# EAGLE schematic shift-one (EAGLE 5.07)
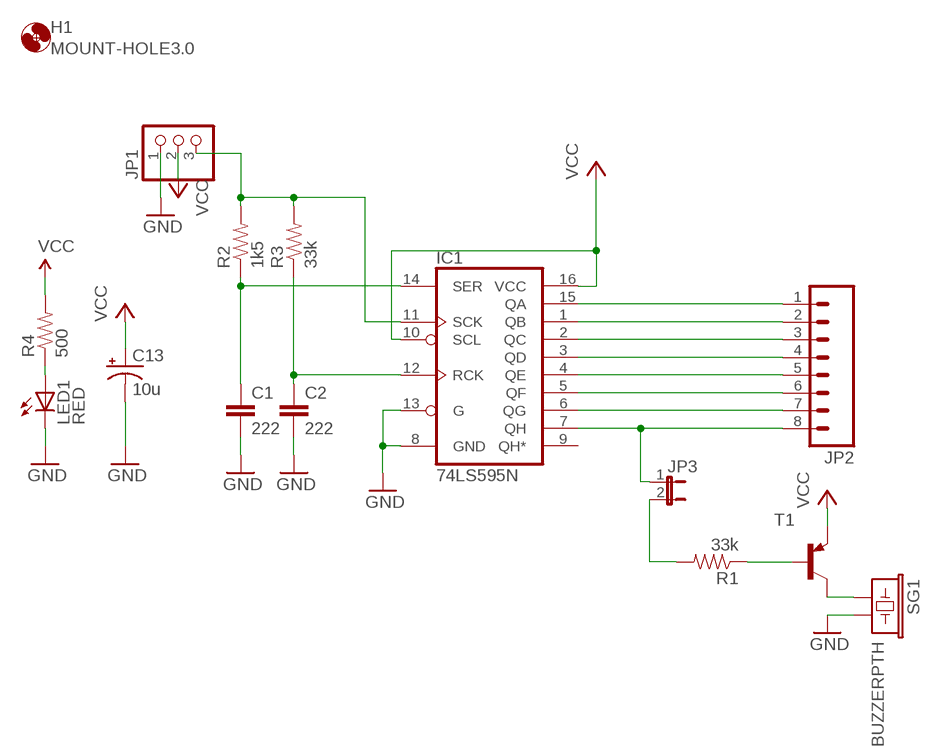
[diagram p0: schematic, sheet 1]

## Parts
C1  222  CAP0805  [0805]
C2  222  CAP0805  [0805]
C13  10u  CAP_POLPTH1  [CPOL-RADIAL-100UF-25V]
H1  MOUNT-HOLE3.0  [3,0]
IC1  74LS595N  [DIL16]
JP1  PINHD-1X3/90  [1X03/90]
JP2  M08LOCK_LONGPADS  [1X08_LOCK_LONGPADS]
JP3  JUMPER-2PTH_LOCK  [1X02_LOCK]
LED1  RED  LED3MM  [LED3MM]
R1  33k  RESISTOR0805  [0805]
R2  1k5  RESISTOR1/4W  [AXIAL-0.3]
R3  33k  RESISTOR0805  [0805]
R4  500  RESISTOR0805  [0805]
SG1  BUZZERPTH  [BUZZER-12MM]
T1  90**-PNP-SOT23-BEC  [SOT23-BEC]

## Nets
GND: C1.2 C2.2 C13.2(-) IC1.8(GND) IC1.13(G) JP1.1 LED1.K(C) SG1.-
N$1: IC1.15(QA) JP2.1
N$2: IC1.1(QB) JP2.2
N$3: IC1.2(QC) JP2.3
N$4: IC1.3(QD) JP2.4
N$5: IC1.4(QE) JP2.5
N$6: IC1.5(QF) JP2.6
N$7: IC1.6(QG) JP2.7
N$9: IC1.11(SCK) JP1.3 R2.P$2 R3.2
N$10: C2.1 IC1.12(RCK) R3.1
N$11: C1.1 IC1.14(SER) R2.P$1
N$12: LED1.A R4.1
N$13: SG1.+ T1.C
N$14: R1.1 T1.B
N$15: JP3.2 R1.2
N$16: IC1.7(QH) JP2.8 JP3.1
VCC: C13.1(+) IC1.10(SCL) IC1.16(VCC) JP1.2 R4.2 T1.E
Unconnected: IC1.9(QH*)

## Library data of the parts
C1 C2 = digital-toy:CAP: Capacitor Standard 0603 ceramic capacitor, and 0.1" leaded capacitor.
C13 = SparkFun:CAP_POL: Capacitor Polarized These are standard SMD and PTH capacitors. Normally 10uF, 47uF, and 100uF in electrolytic and tantalum varieties. Always verify the external diameter of the through hole cap, it varies with capacity, voltage, and manufacturer. The EIA devices should be standard.
H1 = holes:MOUNT-HOLE: MOUNTING HOLE with drill center marker
IC1 = SparkFun:74*595: 8-bit SHIFT REGISTER, output latch
JP1 = pinhead:PINHD-1X3: PIN HEADER
JP2 = SparkFun:M08: Header 8 Standard 8-pin 0.1" header. Use with straight break away headers (SKU : PRT-00116), right angle break away headers (PRT-00553), swiss pins (PRT-00743), machine pins (PRT-00117), and female headers (PRT-00115).
JP3 = SparkFun:JUMPER-2: Jumper Basic 0.1" spaced jumper. Use with breakaway headers.
LED1 = digital-toy:LED: LEDs Standard schematic elements and footprints for 5mm, 3mm, 1206, and 0603 sized LEDs. 5mm - Spark Fun Electronics SKU : COM-00529 (and others) copy led.lbr 0805 led here, by hyl digital-toy. 2010.6.29
R1-R4 = digital-toy:RESISTOR: Resistor Basic schematic elements and footprints for 0603, 1206, and PTH 1/10th watt (small) resistors. digital-toy copy vertical mount of axial-0.3 from rcl.lbr : the 0207/xx
SG1 = digital-toy:BUZZER: Buzzer 12mm Spark Fun Electronics SKU : Comp-Buzzer
T1 = digital-toy:*-PNP-: PNP Transistror